# Altium schematic sheet ADC_GPIO_Breakout.SchDoc
size Letter; Organization: Altium Limited; Address1: L3, 12a Rodborough Rd; Address2: Frenchs Forest; Address3: NSW; Address4: Australia 2086
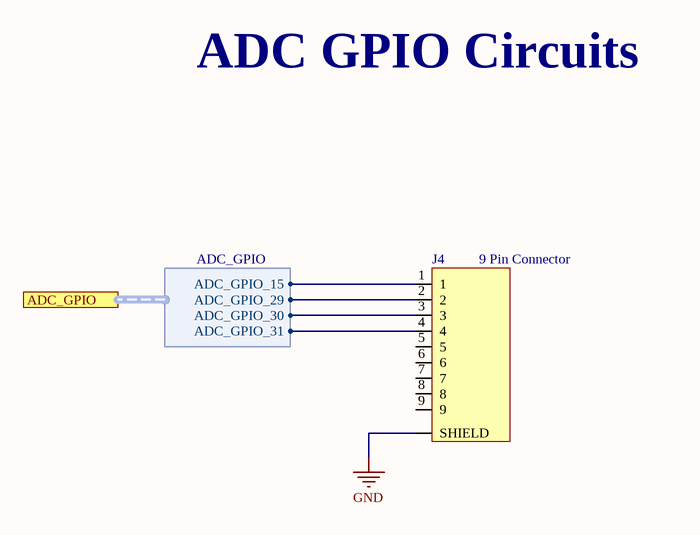
[diagram p0: ADC_GPIO_Breakout.SchDoc]

## Parts
J4  9 Pin Connector  [9-Pos D-Sub]

## Ports
ADC_GPIO (harness ADC_GPIO)

## Harnesses
ADC_GPIO: ADC_GPIO_15, ADC_GPIO_29, ADC_GPIO_30, ADC_GPIO_31

## Nets
GND: J4.SHIELD
NetJ4_1: J4.1 ; port ADC_GPIO.ADC_GPIO_15
NetJ4_2: J4.2 ; port ADC_GPIO.ADC_GPIO_29
NetJ4_3: J4.3 ; port ADC_GPIO.ADC_GPIO_30
NetJ4_4: J4.4 ; port ADC_GPIO.ADC_GPIO_31

Not connected (* = marked no-connect by the designer): J4 5 6 7 8 9

## Notes on the sheet
- ADC GPIO Circuits
- Title
- Size:
- Date:
- Letter
- Number:
- Time:
- Revision:
- Sheet
- of
- File:

## Library data of the parts
J4 = 9-Position Connector: Unknown parameter: 772-E09-213R011